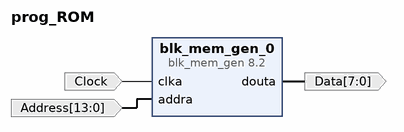
[diagram p0: block diagram of the top level]
# Vivado block design prog_ROM, Vivado 2015.2
create_bd_design prog_ROM

create_bd_port -dir I Clock
create_bd_port -dir O -from 7 -to 0 Data
create_bd_port -dir I -from 13 -to 0 Address

create_bd_cell -type ip -vlnv xilinx.com:ip:blk_mem_gen:8.2 blk_mem_gen_0
set_property -dict [list \
  CONFIG.Memory_Type Single_Port_ROM \
  CONFIG.Enable_32bit_Address false \
  CONFIG.Write_Width_A 8 \
  CONFIG.Write_Depth_A 12288 \
  CONFIG.Enable_A Always_Enabled \
  CONFIG.Register_PortA_Output_of_Memory_Primitives false \
  CONFIG.Load_Init_File true \
  CONFIG.Coe_File ../../../../../../../prog_clean.coe \
  CONFIG.Use_RSTA_Pin false \
  CONFIG.Port_A_Write_Rate 0 \
  CONFIG.Port_B_Clock 0 \
  CONFIG.Port_B_Write_Rate 0 \
  CONFIG.Port_B_Enable_Rate 0 \
  CONFIG.use_bram_block Stand_Alone \
] [get_bd_cells blk_mem_gen_0]

# ---- connections ----

connect_bd_net [get_bd_ports Clock] [get_bd_pins blk_mem_gen_0/clka]
connect_bd_net [get_bd_pins blk_mem_gen_0/douta] [get_bd_ports Data]
connect_bd_net [get_bd_ports Address] [get_bd_pins blk_mem_gen_0/addra]

validate_bd_design
save_bd_design
